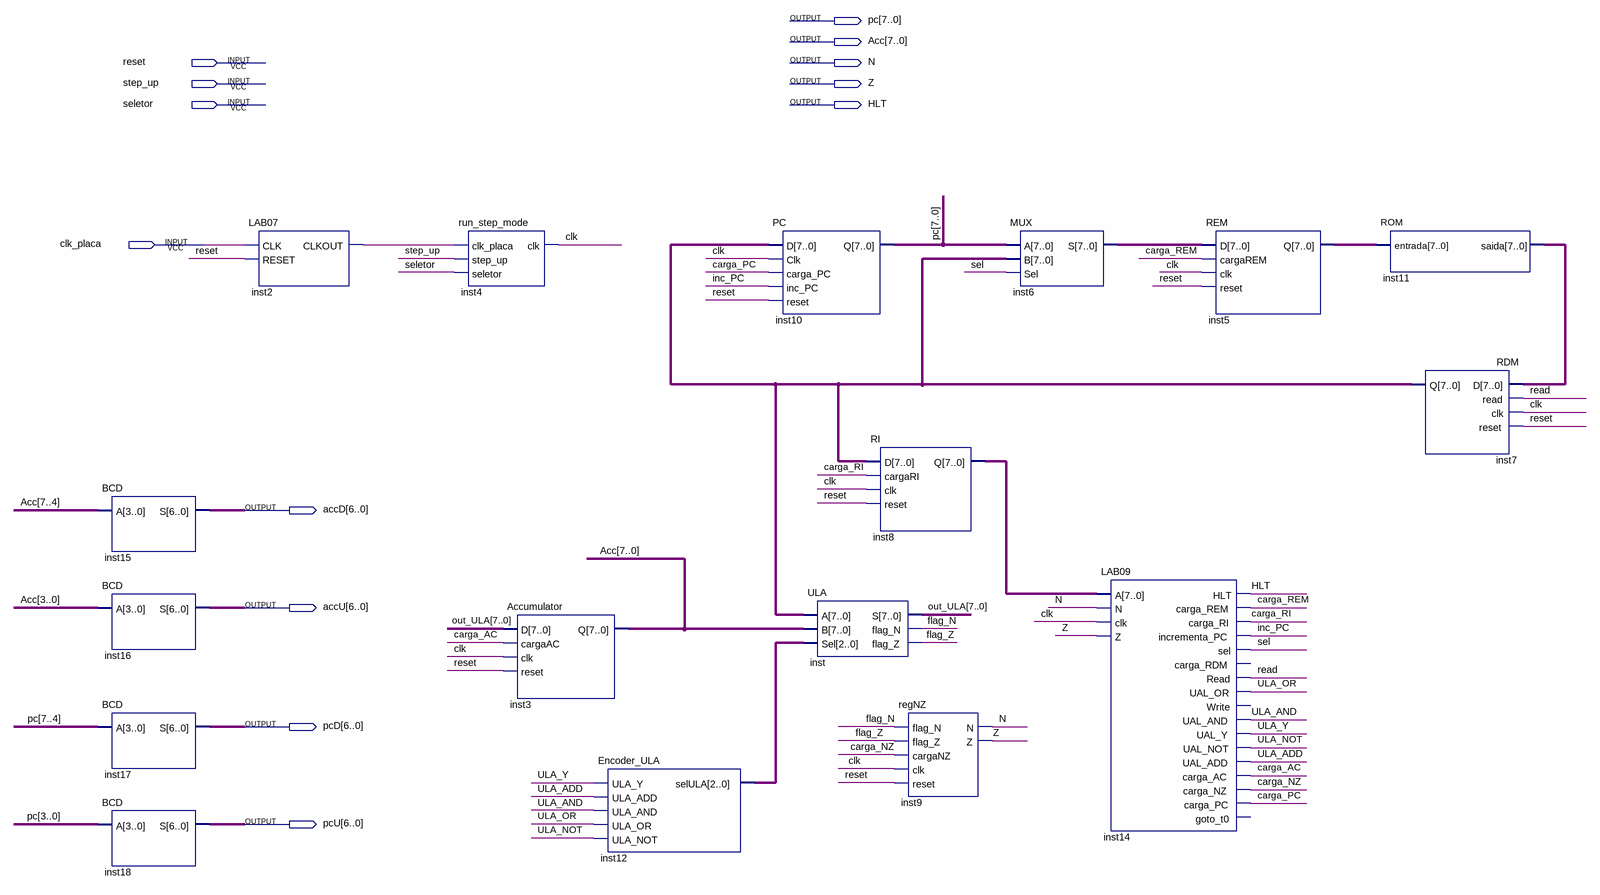
[diagram p0: schematic sheet]
// Quartus schematic Neander.bdf as structural Verilog: 17 symbols, 13 pins
module Neander (
  input  reset,
  input  step_up,
  input  seletor,
  input  clk_placa,
  output [7:0] pc,
  output [7:0] Acc,
  output N,
  output Z,
  output HLT,
  output [6:0] accD,
  output [6:0] accU,
  output [6:0] pcD,
  output [6:0] pcU
);

  wire carga_AC, carga_NZ, carga_PC, carga_REM, carga_RI, clk, flag_N, flag_Z, inc_PC, inst2_clkout, read,
       sel, ULA_ADD, ULA_AND, ULA_NOT, ULA_OR, ULA_Y;
  wire [2:0] inst12_selula;
  wire [7:0] inst5_q, inst6_s, inst7_q, inst8_q, inst11_saida, out_ULA;

  BCD inst15 (.A(Acc[7:4]), .S(accD));
  BCD inst16 (.A(Acc[3:0]), .S(accU));
  BCD inst17 (.A(pc[7:4]), .S(pcD));
  BCD inst18 (.A(pc[3:0]), .S(pcU));
  LAB07 inst2 (.CLK(clk_placa), .RESET(reset), .CLKOUT(inst2_clkout));
  run_step_mode inst4 (.clk_placa(inst2_clkout), .step_up(step_up), .seletor(seletor), .clk(clk));
  Accumulator inst3 (.D(out_ULA), .cargaAC(carga_AC), .clk(clk), .reset(reset), .Q(Acc));
  Encoder_ULA inst12 (
    .ULA_Y(ULA_Y), .ULA_ADD(ULA_ADD), .ULA_AND(ULA_AND), .ULA_OR(ULA_OR), .ULA_NOT(ULA_NOT),
    .selULA(inst12_selula));
  PC inst10 (.D(inst7_q), .Clk(clk), .carga_PC(carga_PC), .inc_PC(inc_PC), .reset(reset), .Q(pc));
  ULA inst (.A(inst7_q), .B(Acc), .Sel(inst12_selula), .S(out_ULA), .flag_N(flag_N), .flag_Z(flag_Z));
  RI inst8 (.D(inst7_q), .cargaRI(carga_RI), .clk(clk), .reset(reset), .Q(inst8_q));
  regNZ inst9 (.flag_N(flag_N), .flag_Z(flag_Z), .cargaNZ(carga_NZ), .clk(clk), .reset(reset), .N(N), .Z(Z));
  MUX inst6 (.A(pc), .B(inst7_q), .Sel(sel), .S(inst6_s));
  LAB09 inst14 (
    .A(inst8_q), .N(N), .clk(clk), .Z(Z), .HLT(HLT), .carga_REM(carga_REM), .carga_RI(carga_RI),
    .incrementa_PC(inc_PC), .sel(sel), .Read(read), .UAL_OR(ULA_OR), .UAL_AND(ULA_AND), .UAL_Y(ULA_Y),
    .UAL_NOT(ULA_NOT), .UAL_ADD(ULA_ADD), .carga_AC(carga_AC), .carga_NZ(carga_NZ), .carga_PC(carga_PC));  // open: carga_RDM, Write, goto_t0
  REM inst5 (.D(inst6_s), .cargaREM(carga_REM), .clk(clk), .reset(reset), .Q(inst5_q));
  ROM inst11 (.entrada(inst5_q), .saida(inst11_saida));
  RDM inst7 (.D(inst11_saida), .read(read), .clk(clk), .reset(reset), .Q(inst7_q));
endmodule
